# EAGLE design Randys_Gut (EAGLE 9.6.2)
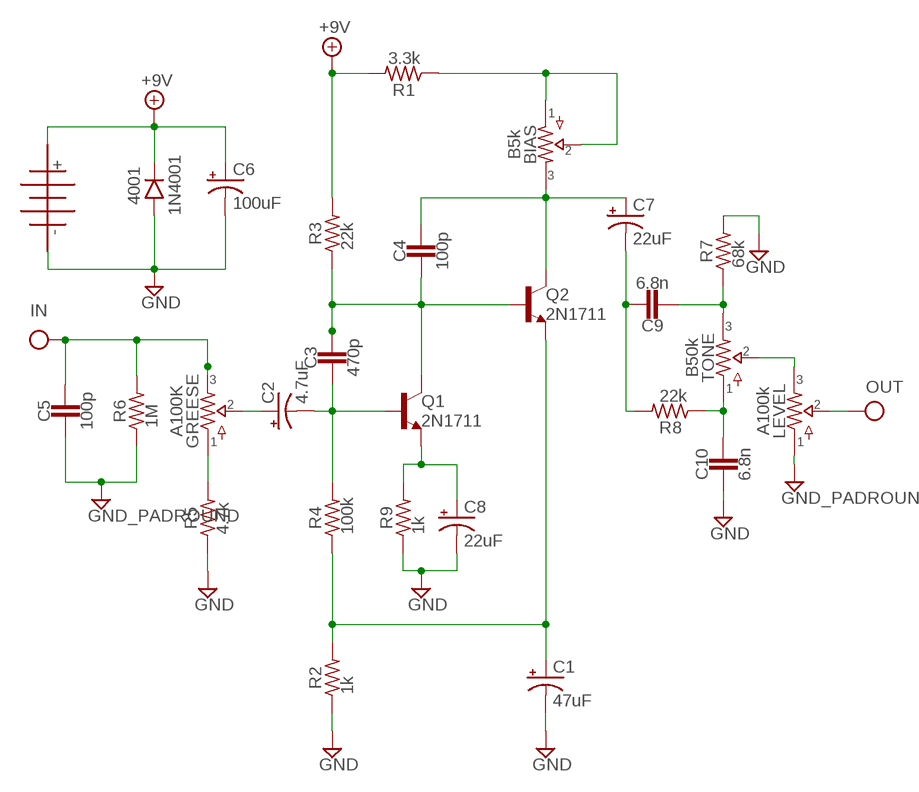
[diagram p0: schematic, sheet 1]

## Parts
4001  1N4001  DO41.3  [DO41-3]
BIAS  B5k  16MM.1  [16MM_B.MOUNT]
C1  47uF  0631  [063_025]
C2  4.7uF  0501  [050_020_1]
C3  470p  CAP.2  [0.2".SML]
C4  100p  CAP.2  [0.2".SML]
C5  100p  CAP.2  [0.2".SML]
C6  100uF  0631  [063_025]
C7  22uF  0501  [050_020_1]
C8  22uF  0501  [050_020_1]
C9  6.8n  CAP.2  [0.2".SML]
C10  6.8n  CAP.2  [0.2".SML]
GI  GND_PADROUND  [ROUND]
GO  GND_PADROUND  [ROUND]
GREESE  A100K  16MM.1  [16MM_B.MOUNT]
IN  IN  [SQUARE]
LEVEL  A100k  16MM.1  [16MM_B.MOUNT]
OUT  OUT  [SQUARE]
PWR  BATTERYBAT2  [BATTERY2]
Q1  2N1711  2N2222A  [TO18]
Q2  2N1711  2N2222A  [TO18]
R1  3.3k  RESISTORS.3B  [R0207/3]
R2  1k  RESISTORS.3B  [R0207/3]
R3  22k  RESISTORS.3B  [R0207/3]
R4  100k  RESISTORS.3B  [R0207/3]
R5  4.7k  RESISTORS.3B  [R0207/3]
R6  1M  RESISTORS.3B  [R0207/3]
R7  68k  RESISTORS.3B  [R0207/3]
R8  22k  RESISTORS.3B  [R0207/3]
R9  1k  RESISTORS.3B  [R0207/3]
TONE  B50k  16MM.1  [16MM_B.MOUNT]

## Nets
+9V: 4001.C C6.+ PWR.P$1 R1.2 R3.2
C3: C2.- C3.2 Q1.2(B) R4.2
GND: 4001.A C1.- C5.2 C6.- C8.- C10.2 GI.1(GND) GO.1(GND) LEVEL.1 PWR.P$2 R2.1 R5.1 R6.1 R7.2 R9.1
IN: C5.1 GREESE.3 IN.1(IN) R6.2
N$1: GREESE.1 R5.2
N$3: C2.+ GREESE.2
N$5: C1.+ Q2.1(E) R2.2 R4.1
N$6: C3.1 C4.2 Q1.3(C) Q2.2(B) R3.1
N$7: C8.+ Q1.1(E) R9.2
N$8: BIAS.3 C4.1 C7.+ Q2.3(C)
N$9: C7.- C9.1 R8.2
N$10: BIAS.1 BIAS.2 R1.1
N$11: C9.2 R7.1 TONE.3
N$12: C10.1 R8.1 TONE.1
N$14: LEVEL.3 TONE.2
OUT: LEVEL.2 OUT.1(OUT)

## Library data of the parts
4001 = diodes:DO41: DO-41 Package Diodes: 1N4001 - 1N40019 Zener Diodes: 1N4728 - 1N4764
BIAS GREESE LEVEL TONE = potentiometers:16MM: 16mm Poteniometers
C1 C6 = caps-elec:063: 33 - 220uF Xicon values at Mouser.com 10V: 220uF; 16V: 100uF; 25V: 100uF; 50V: 33uF
C2 C7 C8 = caps-elec:050: 0.22 - 100uF Xicon values at Mouser.com: 10V: 10 - 100uF; 16V: 2.2 - 47uF; 25V: 0.47 - 47uF; 50V: 0.22 - 22uF
C3-C5 C9 C10 = caps-film:CAP: For Ceramic, Film, MLCC caps
GI GO = supply pins:GND_PAD: Ground use this to hook up ground connections throughout a schematic instead of running wire automatically labels the net "GND"
IN = supply pins:IN: Input obsolete: use Mark instead and label net schematic input label without circuit board terminal/pad labels net "IN" provided as complement to OUT (rarely used)
OUT = supply pins:OUT: Output obsolete: use Mark instead and label net output label without circuit board terminal/pad commonly used as output label on 2nd lug of a potentiometer
PWR = jacks:BATTERY
Q1 Q2 = transistors-BJT:2N2222A: NPN [E]-B-C. TO-18 metal can transistor. 2n2369: http://smallbear-electronics.mybigcommerce.com/transistor-2n2369/
R1 R2 R6 = resistors_values:RESISTORS
R3-R5 R7-R9 = resistors:RESISTORS

## Board
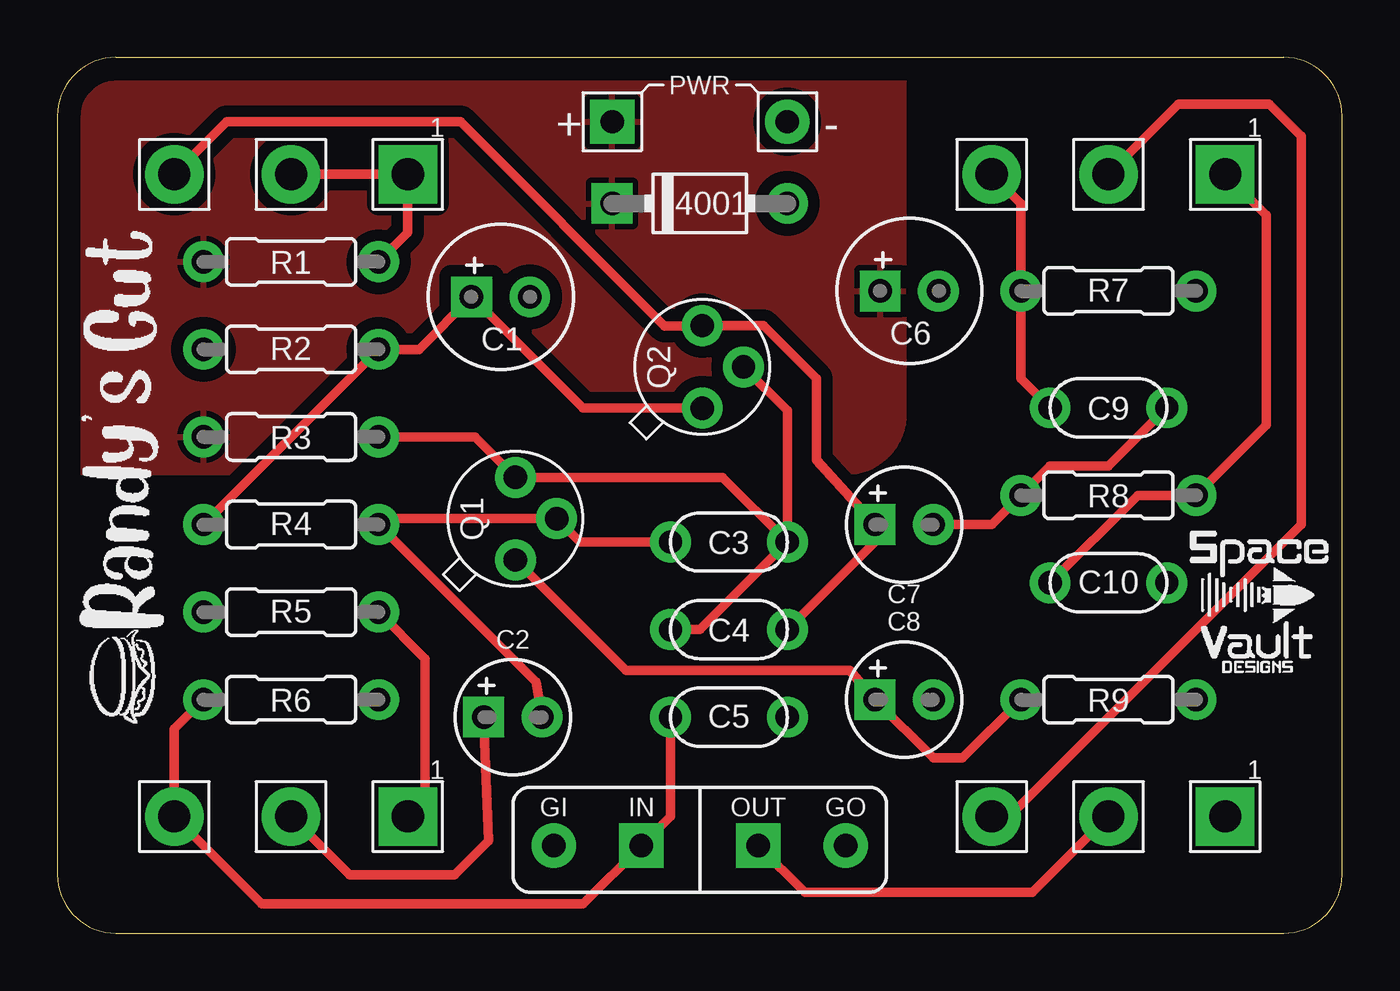
[diagram p1: board, top side]
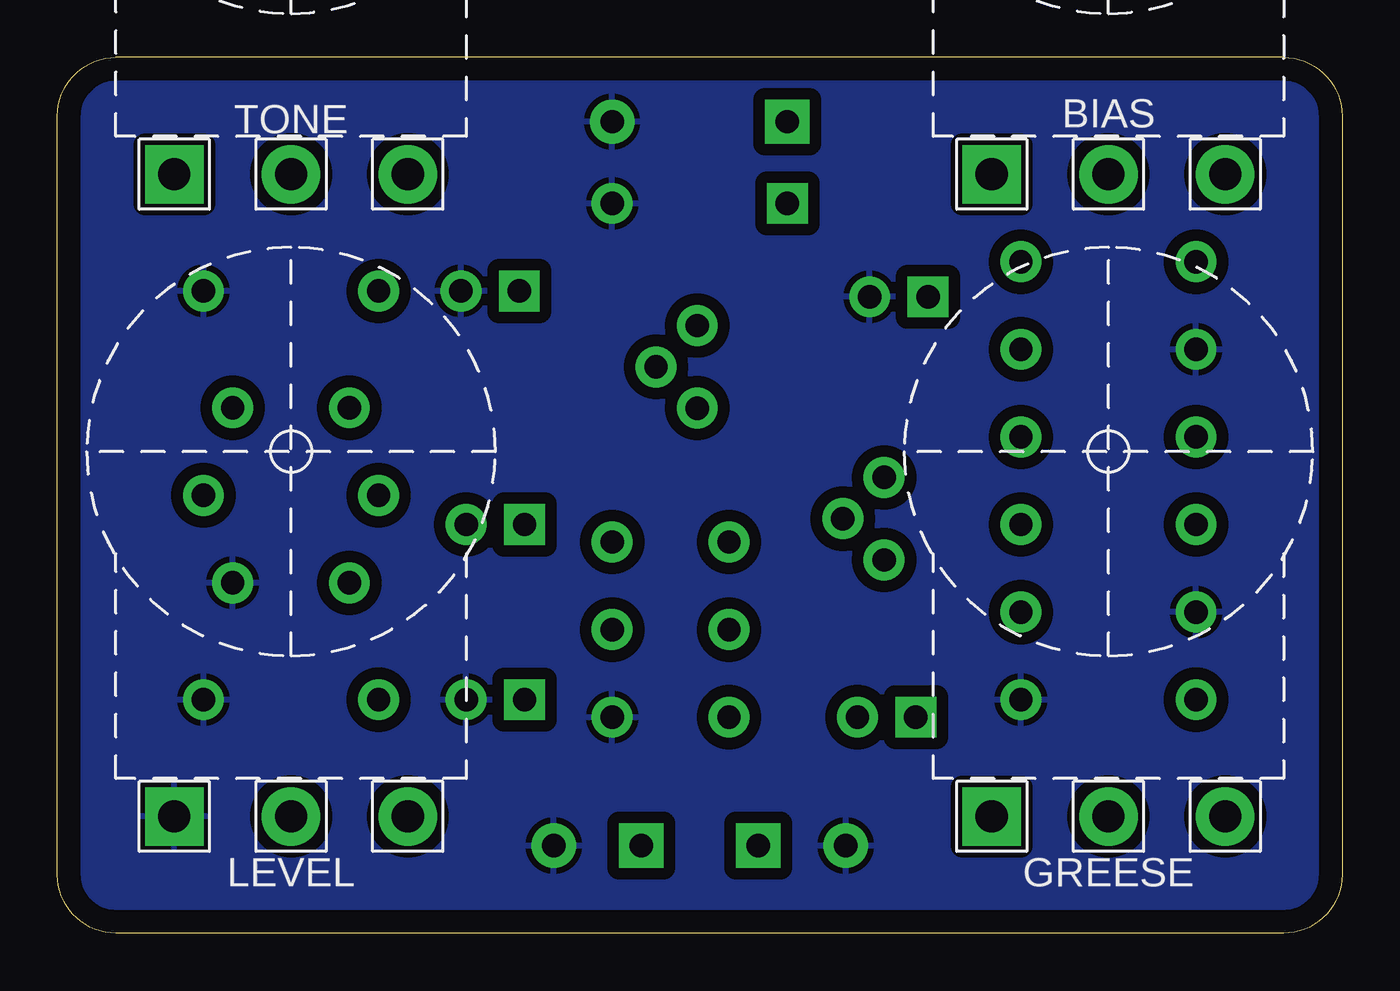
[diagram p2: board, bottom side, seen from below]

Size 55.88 x 38.1 mm. Coordinates in mm from the lower left corner, seen from the top.
Outline: 0,2.54 arc90 2.54,0 53.34,0 arc90 55.88,2.54 55.88,35.56 arc90 53.34,38.1 2.54,38.1 arc90 0,35.56 0,2.54
Copper layers (1*16): Top 0.035mm / dielectric 1.5mm / Bottom 0.035mm
Design rules "default *": minimum track width 6mil, minimum drill 0.35mm, track to track 10mil, track to pad 10mil, pad to pad 10mil, via to via 10mil, smd to smd 10mil, copper to edge 40mil, drill to drill 6mil, minimum pad ring 10mil, minimum via ring 8mil, stop-mask expansion 4mil, vias tented up to drill 0mil, thermal gap 10mil

### Footprints (pad centres in the part's own frame; a part is rotated, then mirrored left to right if it is on the bottom)
DO41-3 = drill 1.016 pad 1.778: A 3.81,0 | drill 1.016 pad 1.778 square: C -3.81,0
16MM_B.MOUNT = drill 1.4 pad 2.54 square: 1 5.08,0 | drill 1.4 pad 2.54: 2 0,0; 3 -5.08,0
063_025 = drill 1.016 pad 1.778 square: + -1.27,0 | drill 1.016 pad 1.778: - 1.27,0
050_020_1 = drill 1.016 pad 1.778 square: + -1.27,0 | drill 1.016 pad 1.778: - 1.27,0
0.2".SML = drill 1.016 pad 1.778: 1 -2.54,0; 2 2.54,0
ROUND = drill 1.016 pad 1.93: 1 0,0
SQUARE = drill 1.016 pad 1.93 square: 1 0,0
BATTERY2 = drill 1.016 pad 1.93 square: P$1 -3.81,0 | drill 1.016 pad 1.93: P$2 3.81,0
TO18 = drill 1.016 pad 1.778: 1 -1.796,-0.109; 2 0,-1.905; 3 1.796,-0.109
R0207/3 = drill 1.016 pad 1.778: 1 -3.81,0; 2 3.81,0

### Placement (x,y rotation side)
4001  27.94,31.75 0 top
BIAS  10.16,33.02 0 top
C1  19.28,27.69 0 top
C2  19.81,9.4 0 top
C3  29.21,17.02 180 top
C4  29.21,13.21 180 top
C5  29.21,9.4 0 top
C6  37.06,27.94 0 top
C7  36.83,17.78 0 top
C8  36.83,10.16 0 top
C9  45.72,22.86 180 top
C10  45.72,15.24 0 top
GI  21.59,3.81 0 top
GO  34.29,3.81 0 top
GREESE  10.16,5.08 0 top
IN  25.4,3.81 0 top
LEVEL  45.72,5.08 0 top
OUT  30.48,3.81 0 top
PWR  27.94,35.31 0 top
Q1  19.81,18.03 90 top
Q2  27.94,24.64 90 top
R1  10.16,29.21 180 top
R2  10.16,25.4 0 top
R3  10.16,21.59 180 top
R4  10.16,17.78 0 top
R5  10.16,13.97 0 top
R6  10.16,10.16 180 top
R7  45.72,27.94 0 top
R8  45.72,19.05 180 top
R9  45.72,10.16 180 top
TONE  45.72,33.02 0 top

### Tracks (layer width: path | path; a pad name or v marks a point on that pad's centre or on a via)
+9V
  pour Top (isolate 0.508): 0,35.56 0,20.07 34.29,20.07 arc90 36.83,22.61 36.83,38.1 2.54,38.1 arc90
C3
  Top 0.406: C2.- 20.81,10.94 R4.2 14.22,18.03 Q1.2 22.73,17.02 C3.2
GND
  pour Bottom (isolate 0.508): 0,35.56 0,2.54 arc90 2.54,0 53.34,0 arc90 55.88,2.54 55.88,35.56 arc90 53.34,38.1 2.54,38.1 arc90
IN
  Top 0.406: R6.2 5.08,8.89 GREESE.3 8.89,1.27 22.86,1.27 IN.1 26.67,5.08 C5.1
N$1
  Top 0.406: GREESE.1 16,5.84 16,11.94 R5.2
N$3
  Top 0.406: GREESE.2 12.7,2.54 17.27,2.54 18.75,4.02 C2.+
N$5
  Top 0.406: R4.1 R2.2 15.72,25.4 C1.+ 22.85,22.84 Q2.1
N$6
  Top 0.406: R3.1 18.16,21.59 Q1.3 28.94,19.83 C3.1 | C3.1 27.94,13.21 C4.2 | Q2.2 31.75,22.73 C3.1
N$7
  Top 0.406: Q1.1 24.73,11.43 34.48,11.43 C8.+ 38.1,7.62 39.37,7.62 R9.2
N$8
  Top 0.406: BIAS.3 7.37,35.31 17.53,35.31 26.42,26.42 28.03,26.42 Q2.3 30.72,26.43 33.02,24.13 33.02,20.59 C7.+ 35.73,17.61 35.76,17.22 C4.1
N$9
  Top 0.406: C7.- 40.64,17.78 R8.2 43.18,20.32 45.72,20.32 C9.1
N$10
  Top 0.406: R1.1 15.24,30.48 BIAS.1 BIAS.2
N$11
  Top 0.406: C9.2 41.91,24.13 R7.1 41.91,31.75 TONE.3
N$12
  Top 0.406: TONE.1 52.58,31.24 52.58,22.1 R8.1 46.99,19.05 C10.1
N$14
  Top 0.406: TONE.2 48.77,36.07 52.72,36.07 54.1,34.68 54.1,17.78 41.4,5.08 LEVEL.3
OUT
  Top 0.406: OUT.1 32.51,1.78 42.42,1.78 LEVEL.2